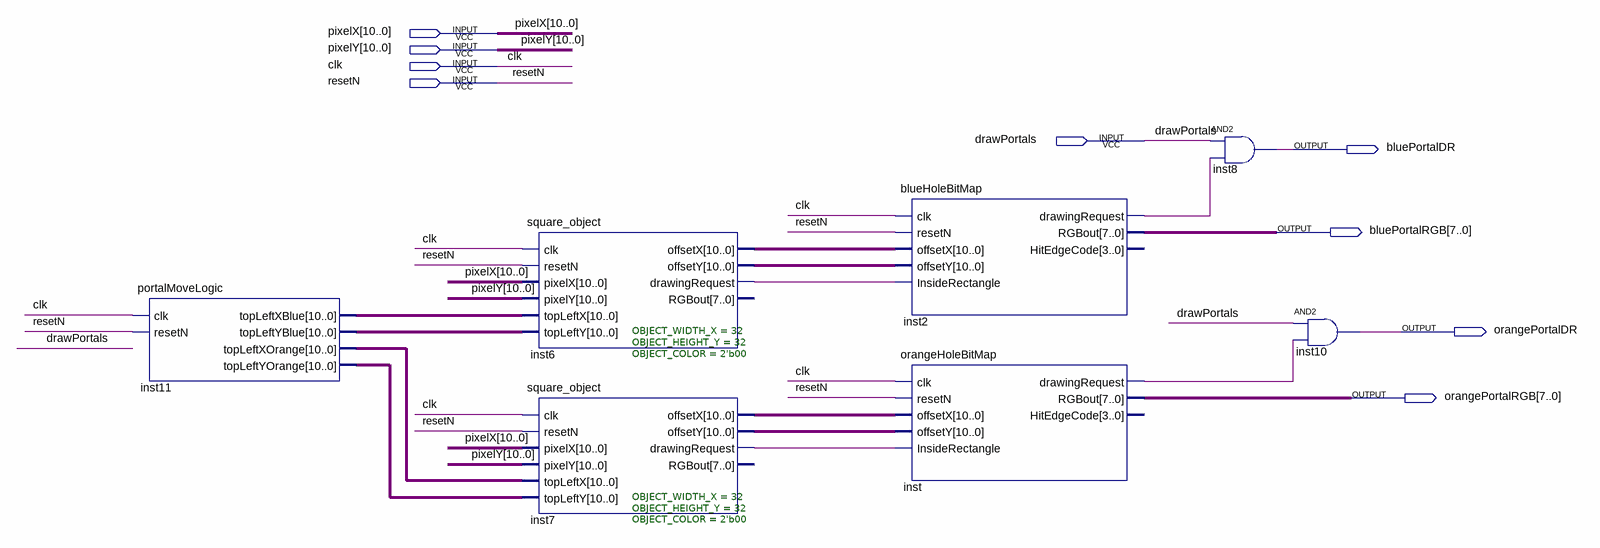
[diagram p0: schematic sheet]
// Quartus schematic portalBlock.bdf as structural Verilog: 7 symbols, 9 pins
module portalBlock (
  input  [10:0] pixelX,
  input  [10:0] pixelY,
  input  clk,
  input  resetN,
  input  drawPortals,
  output bluePortalDR,
  output [7:0] bluePortalRGB,
  output orangePortalDR,
  output [7:0] orangePortalRGB
);

  wire inst2_drawingrequest, inst6_drawingrequest, inst7_drawingrequest, inst_drawingrequest;
  wire [10:0] inst6_offsetx, inst6_offsety, inst7_offsetx, inst7_offsety, inst11_topleftxblue,
       inst11_topleftxorange, inst11_topleftyblue, inst11_topleftyorange;

  portalMoveLogic inst11 (
    .clk(clk), .resetN(resetN), .topLeftXBlue(inst11_topleftxblue), .topLeftYBlue(inst11_topleftyblue),
    .topLeftXOrange(inst11_topleftxorange), .topLeftYOrange(inst11_topleftyorange));
  square_object #(.OBJECT_WIDTH_X(32), .OBJECT_HEIGHT_Y(32), .OBJECT_COLOR(2'b00)) inst6 (
    .clk(clk), .resetN(resetN), .pixelX(pixelX), .pixelY(pixelY), .topLeftX(inst11_topleftxblue),
    .topLeftY(inst11_topleftyblue), .offsetX(inst6_offsetx), .offsetY(inst6_offsety),
    .drawingRequest(inst6_drawingrequest));  // open: RGBout
  square_object #(.OBJECT_WIDTH_X(32), .OBJECT_HEIGHT_Y(32), .OBJECT_COLOR(2'b00)) inst7 (
    .clk(clk), .resetN(resetN), .pixelX(pixelX), .pixelY(pixelY), .topLeftX(inst11_topleftxorange),
    .topLeftY(inst11_topleftyorange), .offsetX(inst7_offsetx), .offsetY(inst7_offsety),
    .drawingRequest(inst7_drawingrequest));  // open: RGBout
  blueHoleBitMap inst2 (
    .clk(clk), .resetN(resetN), .offsetX(inst6_offsetx), .offsetY(inst6_offsety),
    .InsideRectangle(inst6_drawingrequest), .drawingRequest(inst2_drawingrequest), .RGBout(bluePortalRGB));  // open: HitEdgeCode
  orangeHoleBitMap inst (
    .clk(clk), .resetN(resetN), .offsetX(inst7_offsetx), .offsetY(inst7_offsety),
    .InsideRectangle(inst7_drawingrequest), .drawingRequest(inst_drawingrequest), .RGBout(orangePortalRGB));  // open: HitEdgeCode
  and inst8 (bluePortalDR, drawPortals, inst2_drawingrequest);
  and inst10 (orangePortalDR, drawPortals, inst_drawingrequest);
endmodule
